# Altium schematic sheet Sheet1.SchDoc
size A3
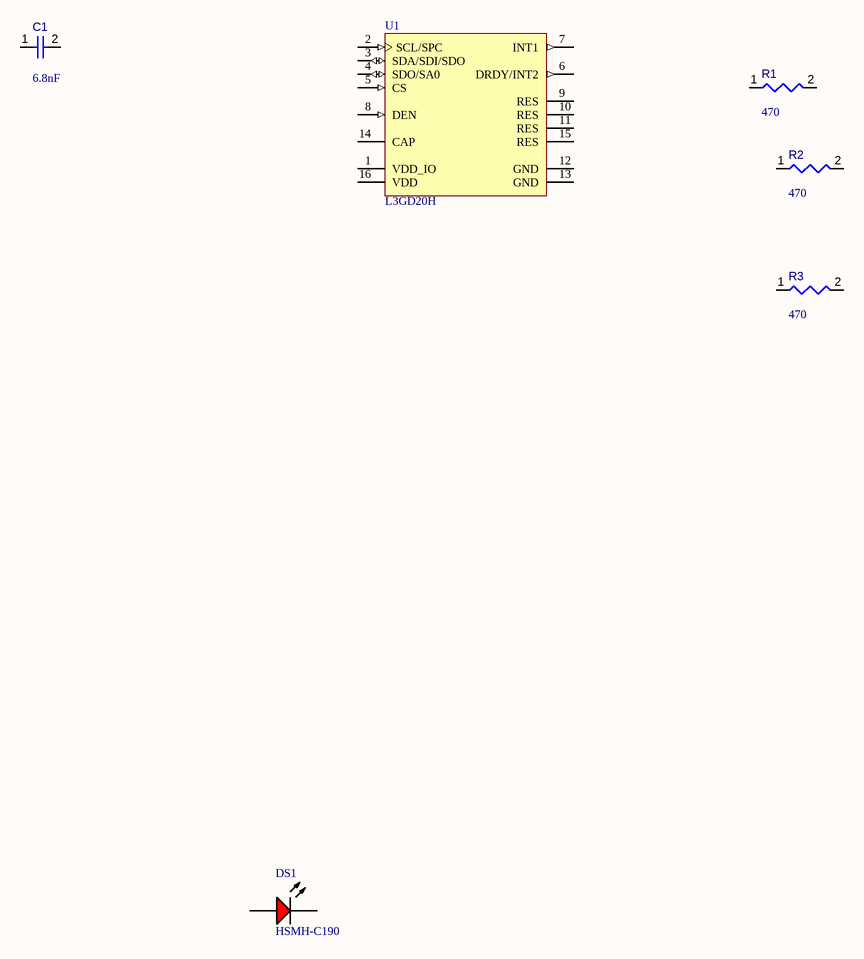
[diagram p0: Sheet1.SchDoc]

## Parts
C1  value 6.8nF  [CAPC1005X56X25ML10T15]  (hidden comment: Capacitor 6.8 nF +/- 10% 16 V 0402)
DS1  HSMH-C190  [AVAG-HSMX-C190_V]
R1  value 470  [RESC0805(2012)_L]  (hidden comment: Resistor 470R +/-5% 0805 125 mW)
R2  value 470  [RESC0805(2012)_L]  (hidden comment: Resistor 470R +/-5% 0805 125 mW)
R3  value 470  [RESC0805(2012)_L]  (hidden comment: Resistor 470R +/-5% 0805 125 mW)
U1  L3GD20H  [STM-LGA-16_M]

## Nets

Not connected (* = marked no-connect by the designer): C1 1 2; DS1 1(A) 2(K); R1 1 2; R2 1 2; R3 1 2; U1 1(VDD_IO) 2(SCL/SPC) 3(SDA/SDI/SDO) 4(SDO/SA0) 5(CS) 6(DRDY/INT2) 7(INT1) 8(DEN) 9(RES) 10(RES) 11(RES) 12(GND) 13(GND) 14(CAP) 15(RES) 16(VDD)

## Library data of the parts
C1 = CMP-001-00000-4: Chip Capacitor, 6.8 nF, +/- 10%, 16 V, 0402 (1005 Metric); Capacitor Type: Ceramic; Voltage Rating: 16V; Case/Package: 0402; Pins: 2; Tolerance: 10%; Mounting Technology: SM; Min Operating Temperature: -55°C; RoHS Compliant: True; Max Operating Temperature: 125°C
DS1 = CMP-007-00014-1: LED Uni-Color Red, 65 mW, 20 mA, -40 to 85 degC, 2-Pin SMD, RoHS, Tape and Reel; Manufacturer: Avago; Nominal Vf: 1.8V; Forward Current: 20mA; Luminous Intensity: 17mcd; Viewing Angle: 170degrees; Lens Style: Diffused; Power: 78mW; Packaging: TapeandReel; Colour: Red; Forward Voltage: 1.8V; Mounting Technology: SM; Case/Package: 0603; Min Operating Temperature: -40°C; Package Reference: HSMX-C190; Pins: 2; Manufacturer URL: http://www.avagotech.com/; RoHS Compliant: True; Max Operating Temperature: 85°C; Package Quantity: 4000; Illumination Colour: Red; Datasheet URL: http://docs.avagotech.com/docs/AV02-0551EN; Package Description: 2-Pin Surface Mount Device, Body 1.6 x 0.8 mm, Height 0.9 mm; Datasheet Version: Mar-12
R1-R3 = CMP-009-00122-2: Chip Resistor, 470 Ohms, +/-5%, 125 mW, -55 to 155 degC, 0805; Power: 125mW; Tolerance: 5%; Max Operating Temperature: 155°C; Min Operating Temperature: -55°C; Pins: 2; Case/Package: 0805
U1 = CMP-010-00011-2: MEMS Motion Sensor: Three-Axis Digital Output Gyroscope, 2.2 to 3.6 V, -40 to 85 degC, 16-Pin LGA, RoHS, Tray; Manufacturer: STMicroelectronics; Max Supply Voltage: 3.6V; Min Supply Voltage: 2.2V; RoHS Compliant: True; Packaging: CutTape; Package Description: 16-Pin Land Grid Array Package, Body 3 x 3 mm, Pitch 0.5 mm; Mounting Technology: SM; Package Reference: LGA-16; Pins: 16; Datasheet Version: Rev. 2, 03/2013; Sensor Type: Motion; Datasheet URL: http://www.st.com/content/ccc/resource/technical/document/datasheet/35/b1/e0/39/71/57/43/01/DM00060659.pdf/files/DM00060659.pdf/jcr:content/translations/en.DM00060659.pdf; Case/Package: LGA